# Altium schematic sheet STM8_remote.SchDoc: 电动滑板遥控器
size A4; Revision: v1.0; SheetNumber: 1; SheetTotal: STM8S遥控器; CurrentTime: 2017/03/13; DocumentName: 电动滑板遥控器
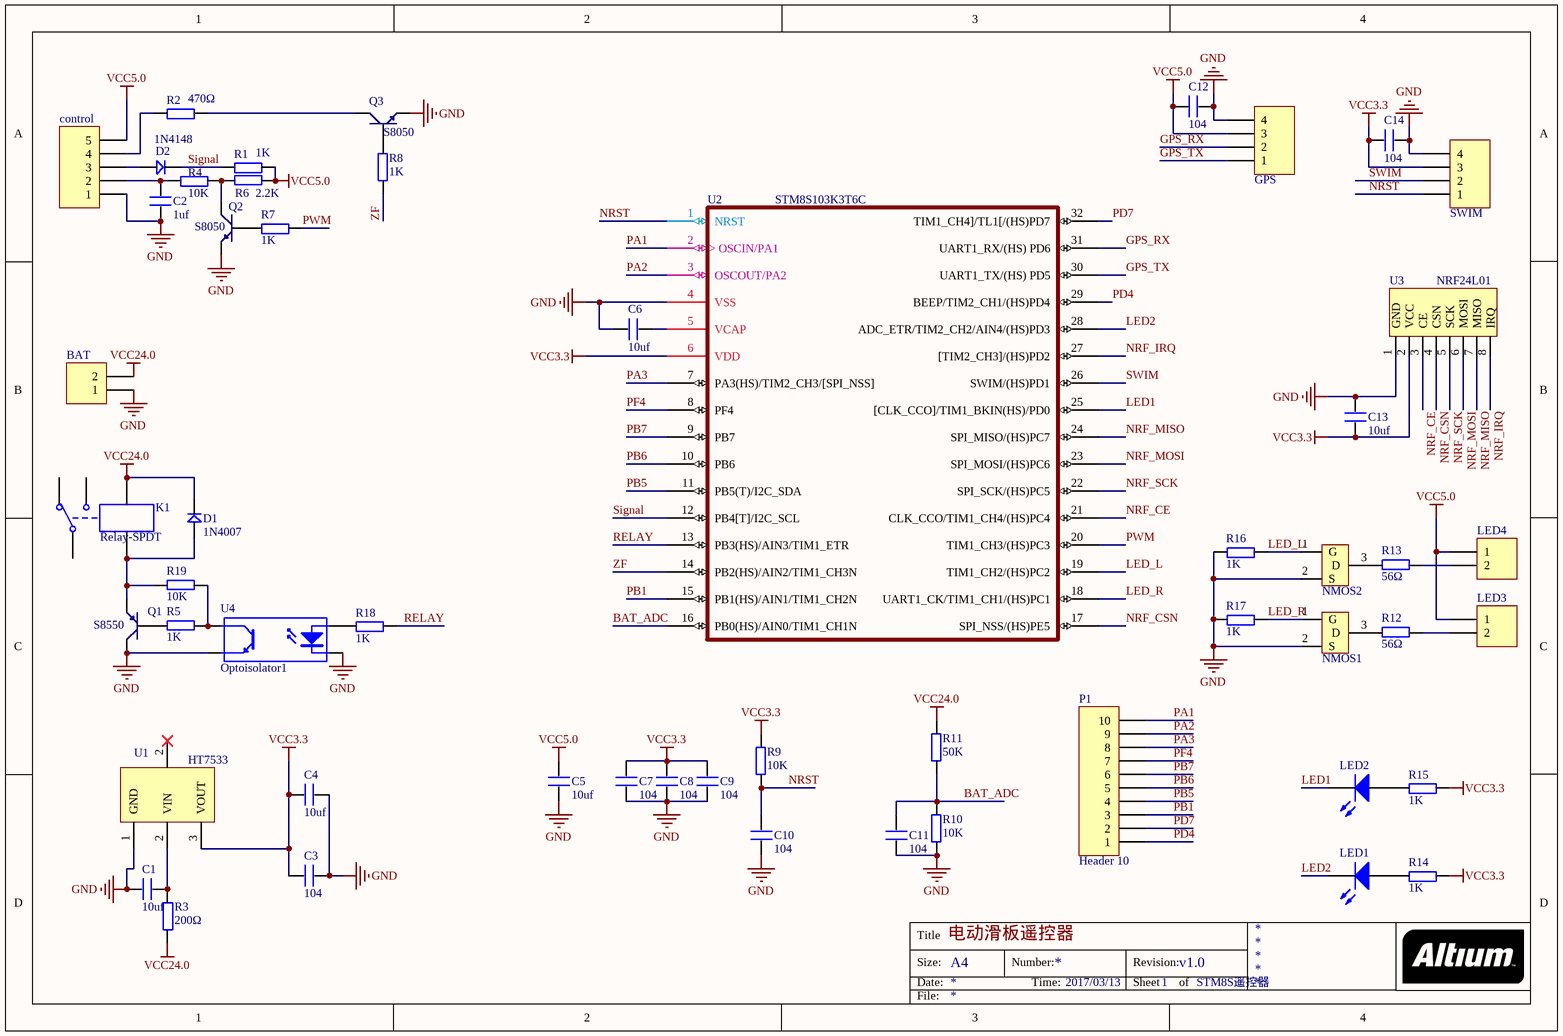
[diagram p0: STM8_remote.SchDoc]

## Parts
BAT  Header 2  [HDR1X2]  (value not drawn)
C1  10uf  [tantalum capacitors]
C2  1uf  [0603P]
C3  104  [0603P]
C4  10uf  [tantalum capacitors]
C5  10uf  [tantalum capacitors]
C6  10uf  [0805]
C7  104  [0603P]
C8  104  [0603P]
C9  104  [0603P]
C10  104  [0603P]
C11  104  [0603P]
C12  104  [0603P]
C13  10uf  [tantalum capacitors]
C14  104  [0603P]
control  Header 5  [HDR1X5]  (value not drawn)
D1  1N4007  [DIODE_3*5.3]
D2  1N4148  [0603P]
GPS  Header 4  [HDR1X4]  (value not drawn)
K1  Relay-SPDT  [RELAY]
LED1  LED1  [SMDLED]  (value not drawn)
LED2  LED1  [SMDLED]  (value not drawn)
LED3  Header 2  [HDR1X2]  (value not drawn)
LED4  Header 2  [HDR1X2]  (value not drawn)
NMOS1  SI2301  [SO-G3/C2.5]  (value not drawn)
NMOS2  SI2301  [SO-G3/C2.5]  (value not drawn)
P1  Header 10  [HDR1X10]
Q1  S8550  [SOT-23R]
Q2  S8050  [SOT-23R]
Q3  S8050  [SOT-23R]
R1  1K  [0603P]
R2  470Ω  [0603P]
R3  200Ω  [0603P]
R4  10K  [0603P]
R5  1K  [0603P]
R6  2.2K  [0603P]
R7  1K  [0603P]
R8  1K  [0603P]
R9  10K  [0603P]
R10  10K  [0603P]
R11  50K  [0603P]
R12  56Ω  [0805]
R13  56Ω  [0805]
R14  1K  [0603P]
R15  1K  [0603P]
R16  1K  [0603P]
R17  1K  [0603P]
R18  1K  [0603P]
R19  10K  [0603P]
SWIM  Header 4  [HDR1X4]  (value not drawn)
U1  HT7533  [SOT-89]
U2  STM8S103K3T6C  [TQFP32]
U3  NRF24L01  [NRF24L01]
U4  Optoisolator1  [DIP-4]

## Nets
GND: BAT.1 C1.1 C2.1 C3.1 C4.1 C5.1 C6.1 C7.1 C8.1 C9.1 C10.1 C11.1 C12.2 C13.1 C14.2 control.1 GPS.4 NMOS1.2(S) NMOS2.2(S) Q1.3(C) Q2.1(E) Q3.1(E) R10.2 R16.1 R17.1 SWIM.4 U1.1(GND) U2.4(VSS) U3.1(GND) U4.2(K) U4.3(E)
VCC3.3: C3.2 C4.2 C7.2 C8.2 C9.2 C13.2 C14.1 R9.1 R14.2 R15.2 SWIM.3 U1.3(VOUT) U2.6(VDD) U3.2(VCC)
VCC5.0: C5.2 C12.1 control.5 GPS.3 LED3.1 LED4.1 R1.2 R6.1
VCC24.0: BAT.2 D1.2 K1.5 R3.1 R11.1
BAT_ADC: C11.2 R10.1 R11.2 U2.16(PB0(HS)/AIN0/TIM1_CH1N)
GPS_RX: GPS.2 U2.31(UART1_RX/(HS)_PD6)
GPS_TX: GPS.1 U2.30(UART1_TX/(HS)_PD5)
LED1: LED2.2(K) U2.25([CLK_CCO]/TIM1_BKIN(HS)/PD0)
LED2: LED1.2(K) U2.28(ADC_ETR/TIM2_CH2/AIN4/(HS)PD3)
LED_L: NMOS2.1(G) R16.2 U2.19(TIM1_CH2/(HS)PC2)
LED_R: NMOS1.1(G) R17.2 U2.18(UART1_CK/TIM1_CH1/(HS)PC1)
NRF_CE: U2.21(CLK_CCO/TIM1_CH4/(HS)PC4) U3.3(CE)
NRF_CSN: U2.17(SPI_NSS/(HS)PE5) U3.4(CSN)
NRF_IRQ: U2.27([TIM2_CH3]/(HS)PD2) U3.8(IRQ)
NRF_MISO: U2.24(SPI_MISO/(HS)PC7) U3.7(MISO)
NRF_MOSI: U2.23(SPI_MOSI/(HS)PC6) U3.6(MOSI)
NRF_SCK: U2.22(SPI_SCK/(HS)PC5) U3.5(SCK)
NRST: C10.2 R9.2 SWIM.1 U2.1(NRST)
PA1: P1.10 U2.2(OSCIN/PA1)
PA2: P1.9 U2.3(OSCOUT/PA2)
PA3: P1.8 U2.7(PA3(HS)/TIM2_CH3/[SPI_NSS])
PB1: P1.3 U2.15(PB1(HS)/AIN1/TIM1_CH2N)
PB5: P1.4 U2.11(PB5(T)/I2C_SDA)
PB6: P1.5 U2.10(PB6)
PB7: P1.6 U2.9(PB7)
PD4: P1.1 U2.29(BEEP/TIM2_CH1/(HS)PD4)
PD7: P1.2 U2.32(TIM1_CH4]/TL1[/(HS)PD7)
PF4: P1.7 U2.8(PF4)
PWM: R7.2 U2.20(TIM1_CH3/(HS)PC3)
RELAY: R18.2 U2.13(PB3(HS)/AIN3/TIM1_ETR)
Signal: D2.2 R1.1 U2.12(PB4[T]/I2C_SCL)
SWIM: SWIM.2 U2.26(SWIM/(HS)PD1)
ZF: R8.2 U2.14(PB2(HS)/AIN2/TIM1_CH3N)
NetC1_2: C1.2 R3.2 U1.2(VIN)
NetC2_2: C2.2 control.2 R4.1
NetC6_2: C6.2 U2.5(VCAP)
Netcontrol_3: control.3 D2.1
Netcontrol_4: control.4 R2.1
NetD1_1: D1.1 K1.4 Q1.1(E) R19.2
NetLED1_1: LED1.1(A) R14.1
NetLED2_1: LED2.1(A) R15.1
NetLED3_2: LED3.2 R12.1
NetLED4_2: LED4.2 R13.1
NetNMOS1_3: NMOS1.3(D) R12.2
NetNMOS2_3: NMOS2.3(D) R13.2
NetQ1_2: Q1.2(B) R5.2
NetQ2_2: Q2.2(B) R7.1
NetQ2_3: Q2.3(C) R4.2 R6.2
NetQ3_2: Q3.2(B) R8.1
NetQ3_3: Q3.3(C) R2.2
NetR5_1: R5.1 R19.1 U4.4(C)
NetR18_1: R18.1 U4.1(A)

Not connected (* = marked no-connect by the designer): K1 1 2 3

## Notes on the sheet
- Title
- Size:
- Date:
- A4
- Number:
- Time:
- Revision:
- Sheet
- of
- File:

## Library data of the parts
BAT LED3 LED4 = Header 2: Header, 2-Pin; LatestRevisionDate: 17-Jul-2002; LatestRevisionNote: Re-released for DXP Platform.; Publisher: Altium Limited
C1-C14 = C
control = Header 5: Header, 5-Pin; LatestRevisionDate: 17-Jul-2002; LatestRevisionNote: Re-released for DXP Platform.; Publisher: Altium Limited
D1 D2 = D
GPS SWIM = Header 4: Header, 4-Pin; LatestRevisionDate: 17-Jul-2002; LatestRevisionNote: Re-released for DXP Platform.; Publisher: Altium Limited
K1 = Relay-SPDT: Single-Pole Dual-Throw Relay; pin to pad: 1>5 2>4 4>2 5>1; Published: 24-Mar-1999; LatestRevisionDate: 17-Jul-2002; LatestRevisionNote: Re-released for DXP Platform.; PackageReference: MODULE5B; Publisher: Altium Limited
LED1 LED2 = LED2: Typical RED, GREEN, YELLOW, AMBER GaAs LED; Published: 8-Jun-2000; LatestRevisionDate: 17-Jul-2002; LatestRevisionNote: Re-released for DXP Platform.; PackageDocument: Feb-2002; PackageReference: 3.2X1.6X1.1; Publisher: Altium Limited
NMOS1 NMOS2 = MOS-P: IRLML6401/SI2301
P1 = Header 10: Header, 10-Pin; LatestRevisionDate: 17-Jul-2002; LatestRevisionNote: Re-released for DXP Platform.; Publisher: Altium Limited
Q1 = PNP: 8550/BCW68
Q2 Q3 = NPN: 8050/BCW846/BCW847
R1-R19 = R
U1 = HT75xx
U2 = STM8S103K3T6: ST 8-bit  Microcontroller
U4 = Optoisolator1: 4-Pin Phototransistor Optocoupler; Published: 24-Mar-1999; LatestRevisionDate: 04-Mar-2005; LatestRevisionNote: Sch pins 3 & 4 Swapped.; DatasheetDocument: Nov-2003; PackageReference: DIP-4; Publisher: Altium Limited